# Altium project OSSI-1 COMMS.PrjPcb
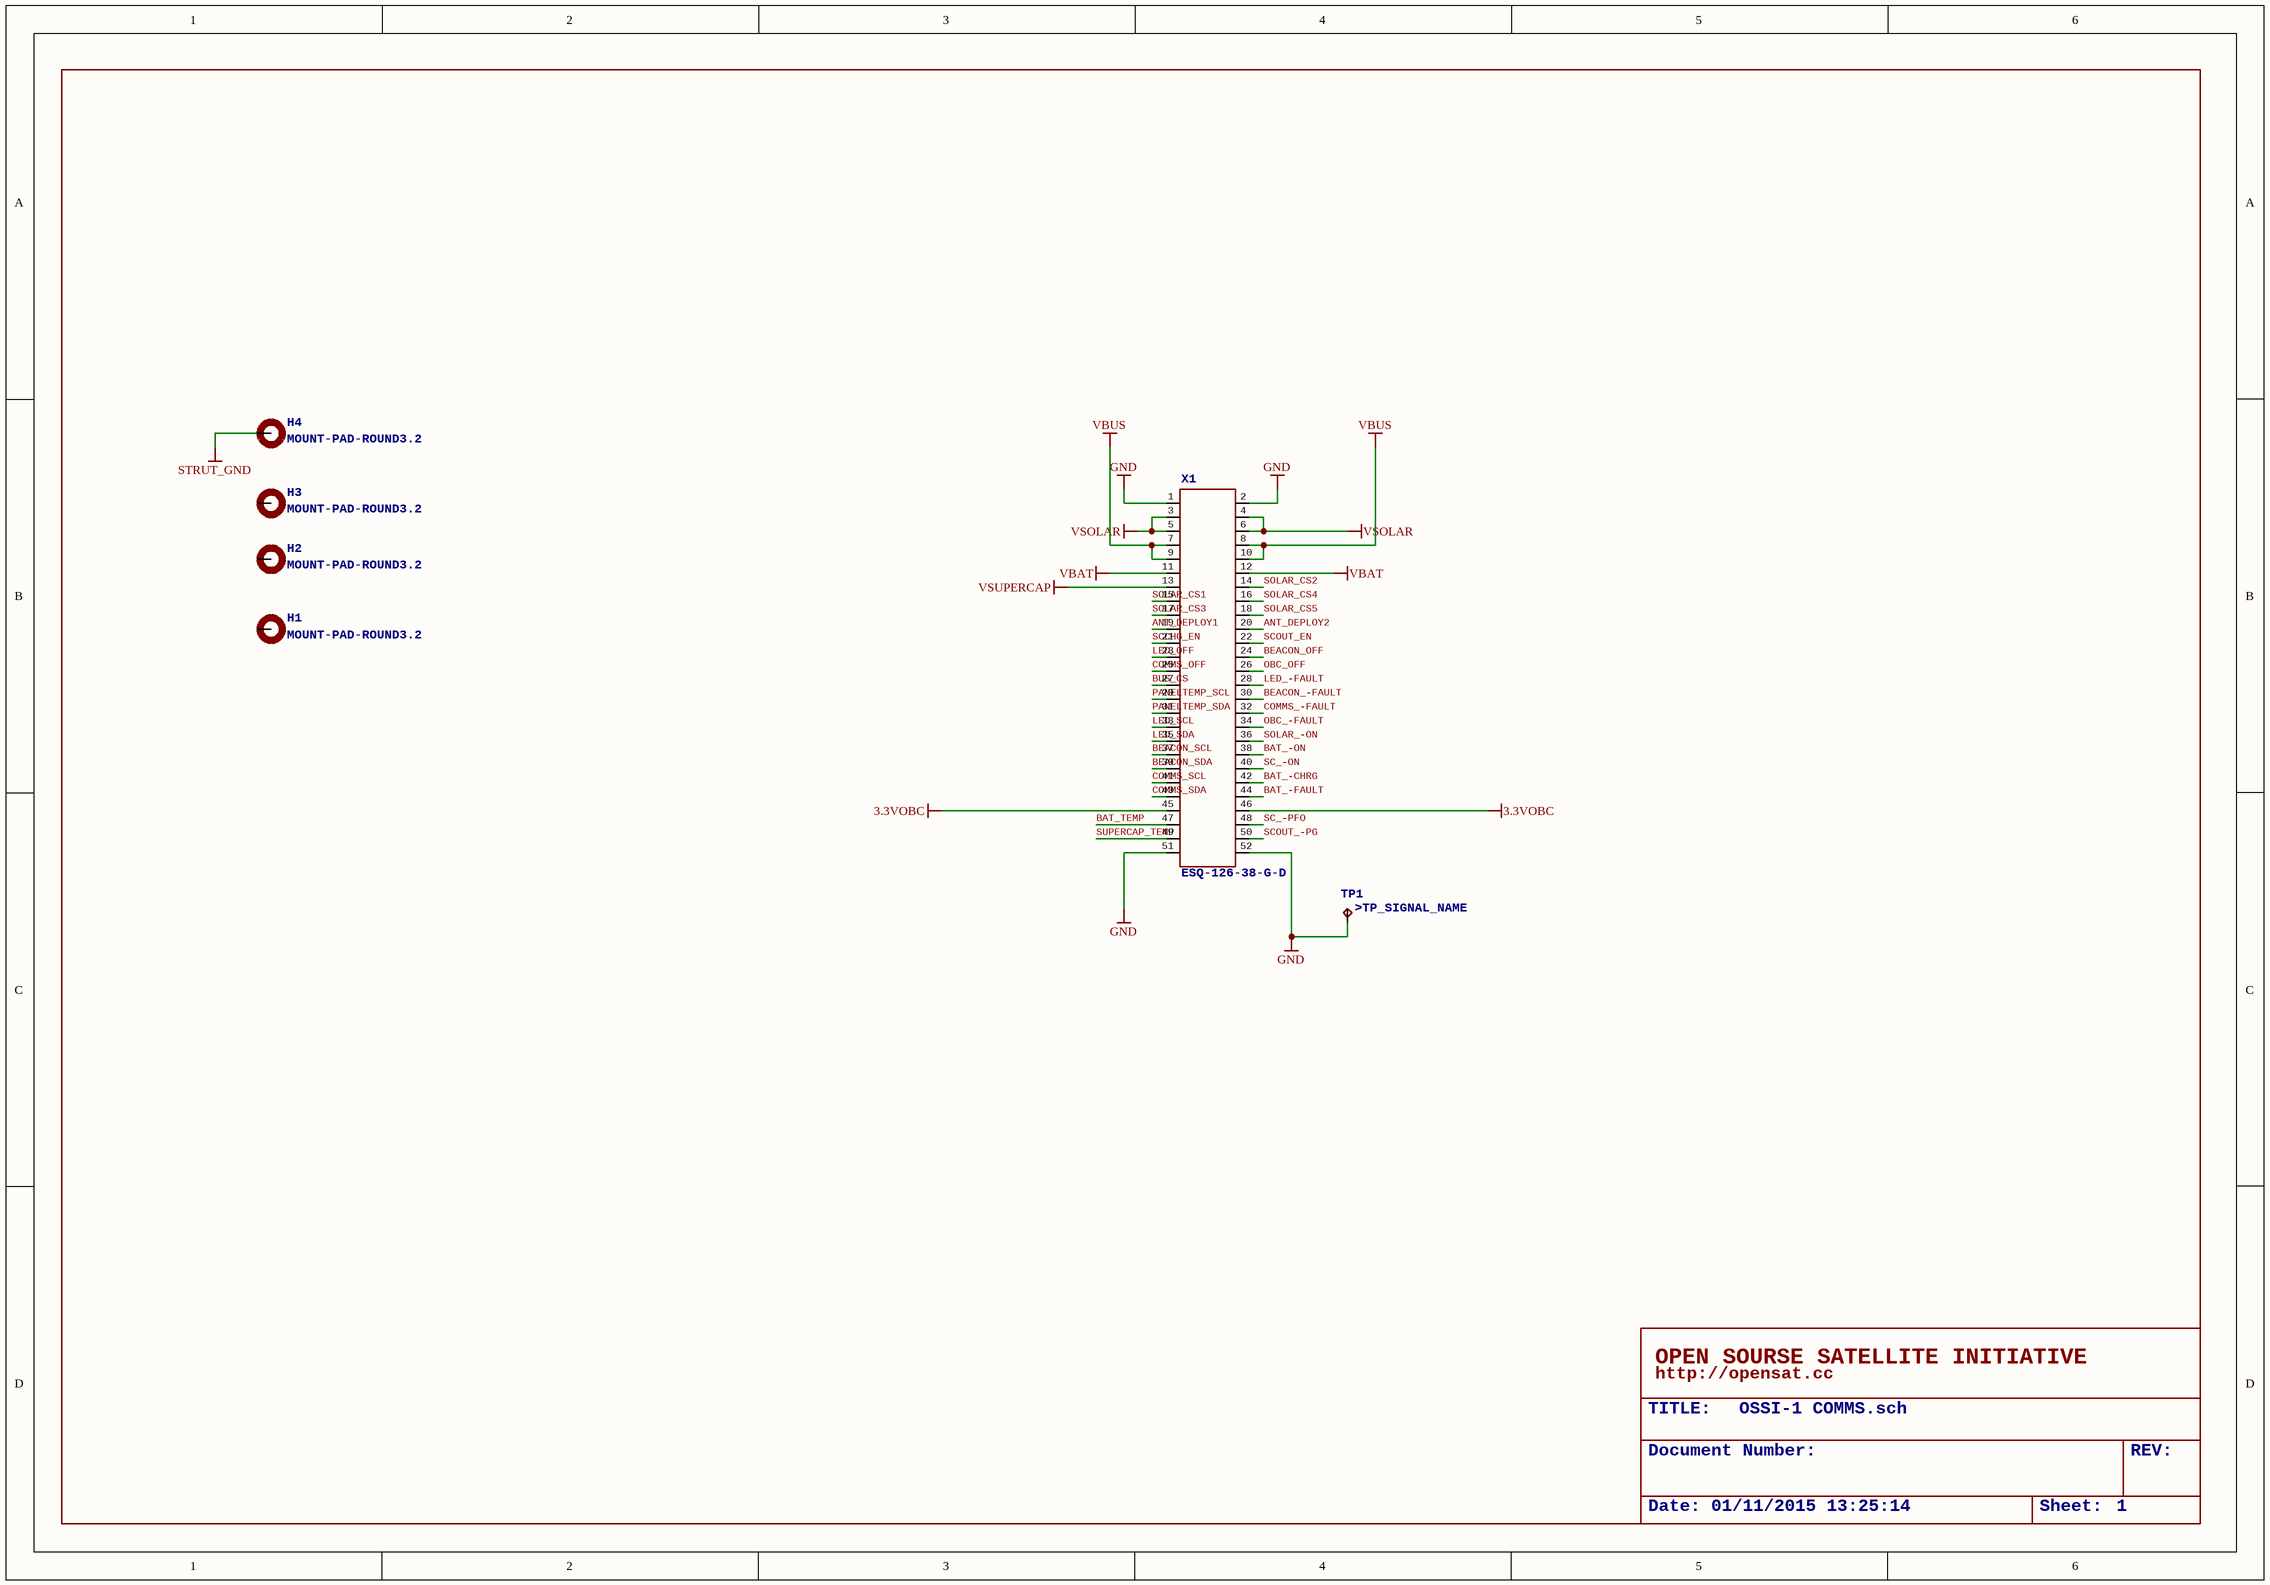
[diagram p0: OSSI-1 COMMS_0.SchDoc]
4 sheets, 188 parts. Net scope: global (net labels, ports and power ports of the same name join across sheets).
Board file: OSSI-1 COMMS.PcbDoc
Sheets:
  OSSI-1 COMMS_0.SchDoc
  OSSI-1 COMMS_1.SchDoc
  OSSI-1 COMMS_2.SchDoc
  OSSI-1 COMMS_3.SchDoc

## Sheet OSSI-1 COMMS_0.SchDoc: TITLE:
size 410 x 286 mm; Date: Date:; >LAST_DATE_TIME: 01/11/2015 13:25:14; Sheet:: Sheet:; >SHEET: 1; REV:: REV:; Document Number:: Document Number:; >DRAWING_NAME: OSSI-1 COMMS.sch

### Parts
H1  >NAME: H1  [3.2-PAD-ROUND]  (hidden comment: MOUNT-PAD-ROUND3.2)
H2  >NAME: H2  [3.2-PAD-ROUND]  (hidden comment: MOUNT-PAD-ROUND3.2)
H3  >NAME: H3  [3.2-PAD-ROUND]  (hidden comment: MOUNT-PAD-ROUND3.2)
H4  >NAME: H4  [3.2-PAD-ROUND]  (hidden comment: MOUNT-PAD-ROUND3.2)
TP1  >NAME: TP1  [TP-13]  (hidden comment: TP)
X1  >NAME: X1  [ESQ-126-XX-X-D]  (hidden comment: ESQ-126-38-G-D)

### Nets
3.3VOBC: X1.45 X1.46
GND: TP1.TP X1.1 X1.2 X1.51 X1.52
STRUT_GND: H4.B3,2(MOUNT)
VBAT: X1.11 X1.12
VBUS: X1.7 X1.8 X1.9 X1.10
VSOLAR: X1.3 X1.4 X1.5 X1.6
VSUPERCAP: X1.13
ANT_DEPLOY1: X1.19
ANT_DEPLOY2: X1.20
BAT_-CHRG: X1.42
BAT_-FAULT: X1.44
BAT_-ON: X1.38
BAT_TEMP: X1.47
BEACON_-FAULT: X1.30
BEACON_OFF: X1.24
BEACON_SCL: X1.37
BEACON_SDA: X1.39
BUS_CS: X1.27
COMMS_-FAULT: X1.32
COMMS_OFF: X1.25
COMMS_SCL: X1.41
COMMS_SDA: X1.43
LED_-FAULT: X1.28
LED_OFF: X1.23
LED_SCL: X1.33
LED_SDA: X1.35
OBC_-FAULT: X1.34
OBC_OFF: X1.26
PANELTEMP_SCL: X1.29
PANELTEMP_SDA: X1.31
SC_-ON: X1.40
SC_-PFO: X1.48
SCCHG_EN: X1.21
SCOUT_-PG: X1.50
SCOUT_EN: X1.22
SOLAR_-ON: X1.36
SOLAR_CS1: X1.15
SOLAR_CS2: X1.14
SOLAR_CS3: X1.17
SOLAR_CS4: X1.16
SOLAR_CS5: X1.18
SUPERCAP_TEMP: X1.49

Not connected (* = marked no-connect by the designer): H1 B3,2(MOUNT); H2 B3,2(MOUNT); H3 B3,2(MOUNT)

### Notes on the sheet
- OPEN SOURSE SATELLITE INITIATIVE
- http://opensat.cc

### Library data of the parts
X1 = ESQ-126-38-G-D: <b>Samtec ESQ-126-XX-G-D Elevated Sockets Seires</b> / <ul> / <li> ESQ-126-37-G-D</li> / <li> ESQ-126-38-G-D</li> / <li> ESQ-126-39-G-D</li> / </ul>; >VALUE: ESQ-126-38-G-D
H1-H4 = MOUNT-PAD-ROUND3.2: >VALUE: MOUNT-PAD-ROUND3.2
TP1 = TP: >TP_SIGNAL_NAME: >TP_SIGNAL_NAME

## Sheet OSSI-1 COMMS_1.SchDoc: TITLE:
size 410 x 287 mm; Date: Date:; >LAST_DATE_TIME: 01/11/2015 13:25:17; Sheet:: Sheet:; >SHEET: 2; REV:: REV:; Document Number:: Document Number:; >DRAWING_NAME: OSSI-1 COMMS.sch
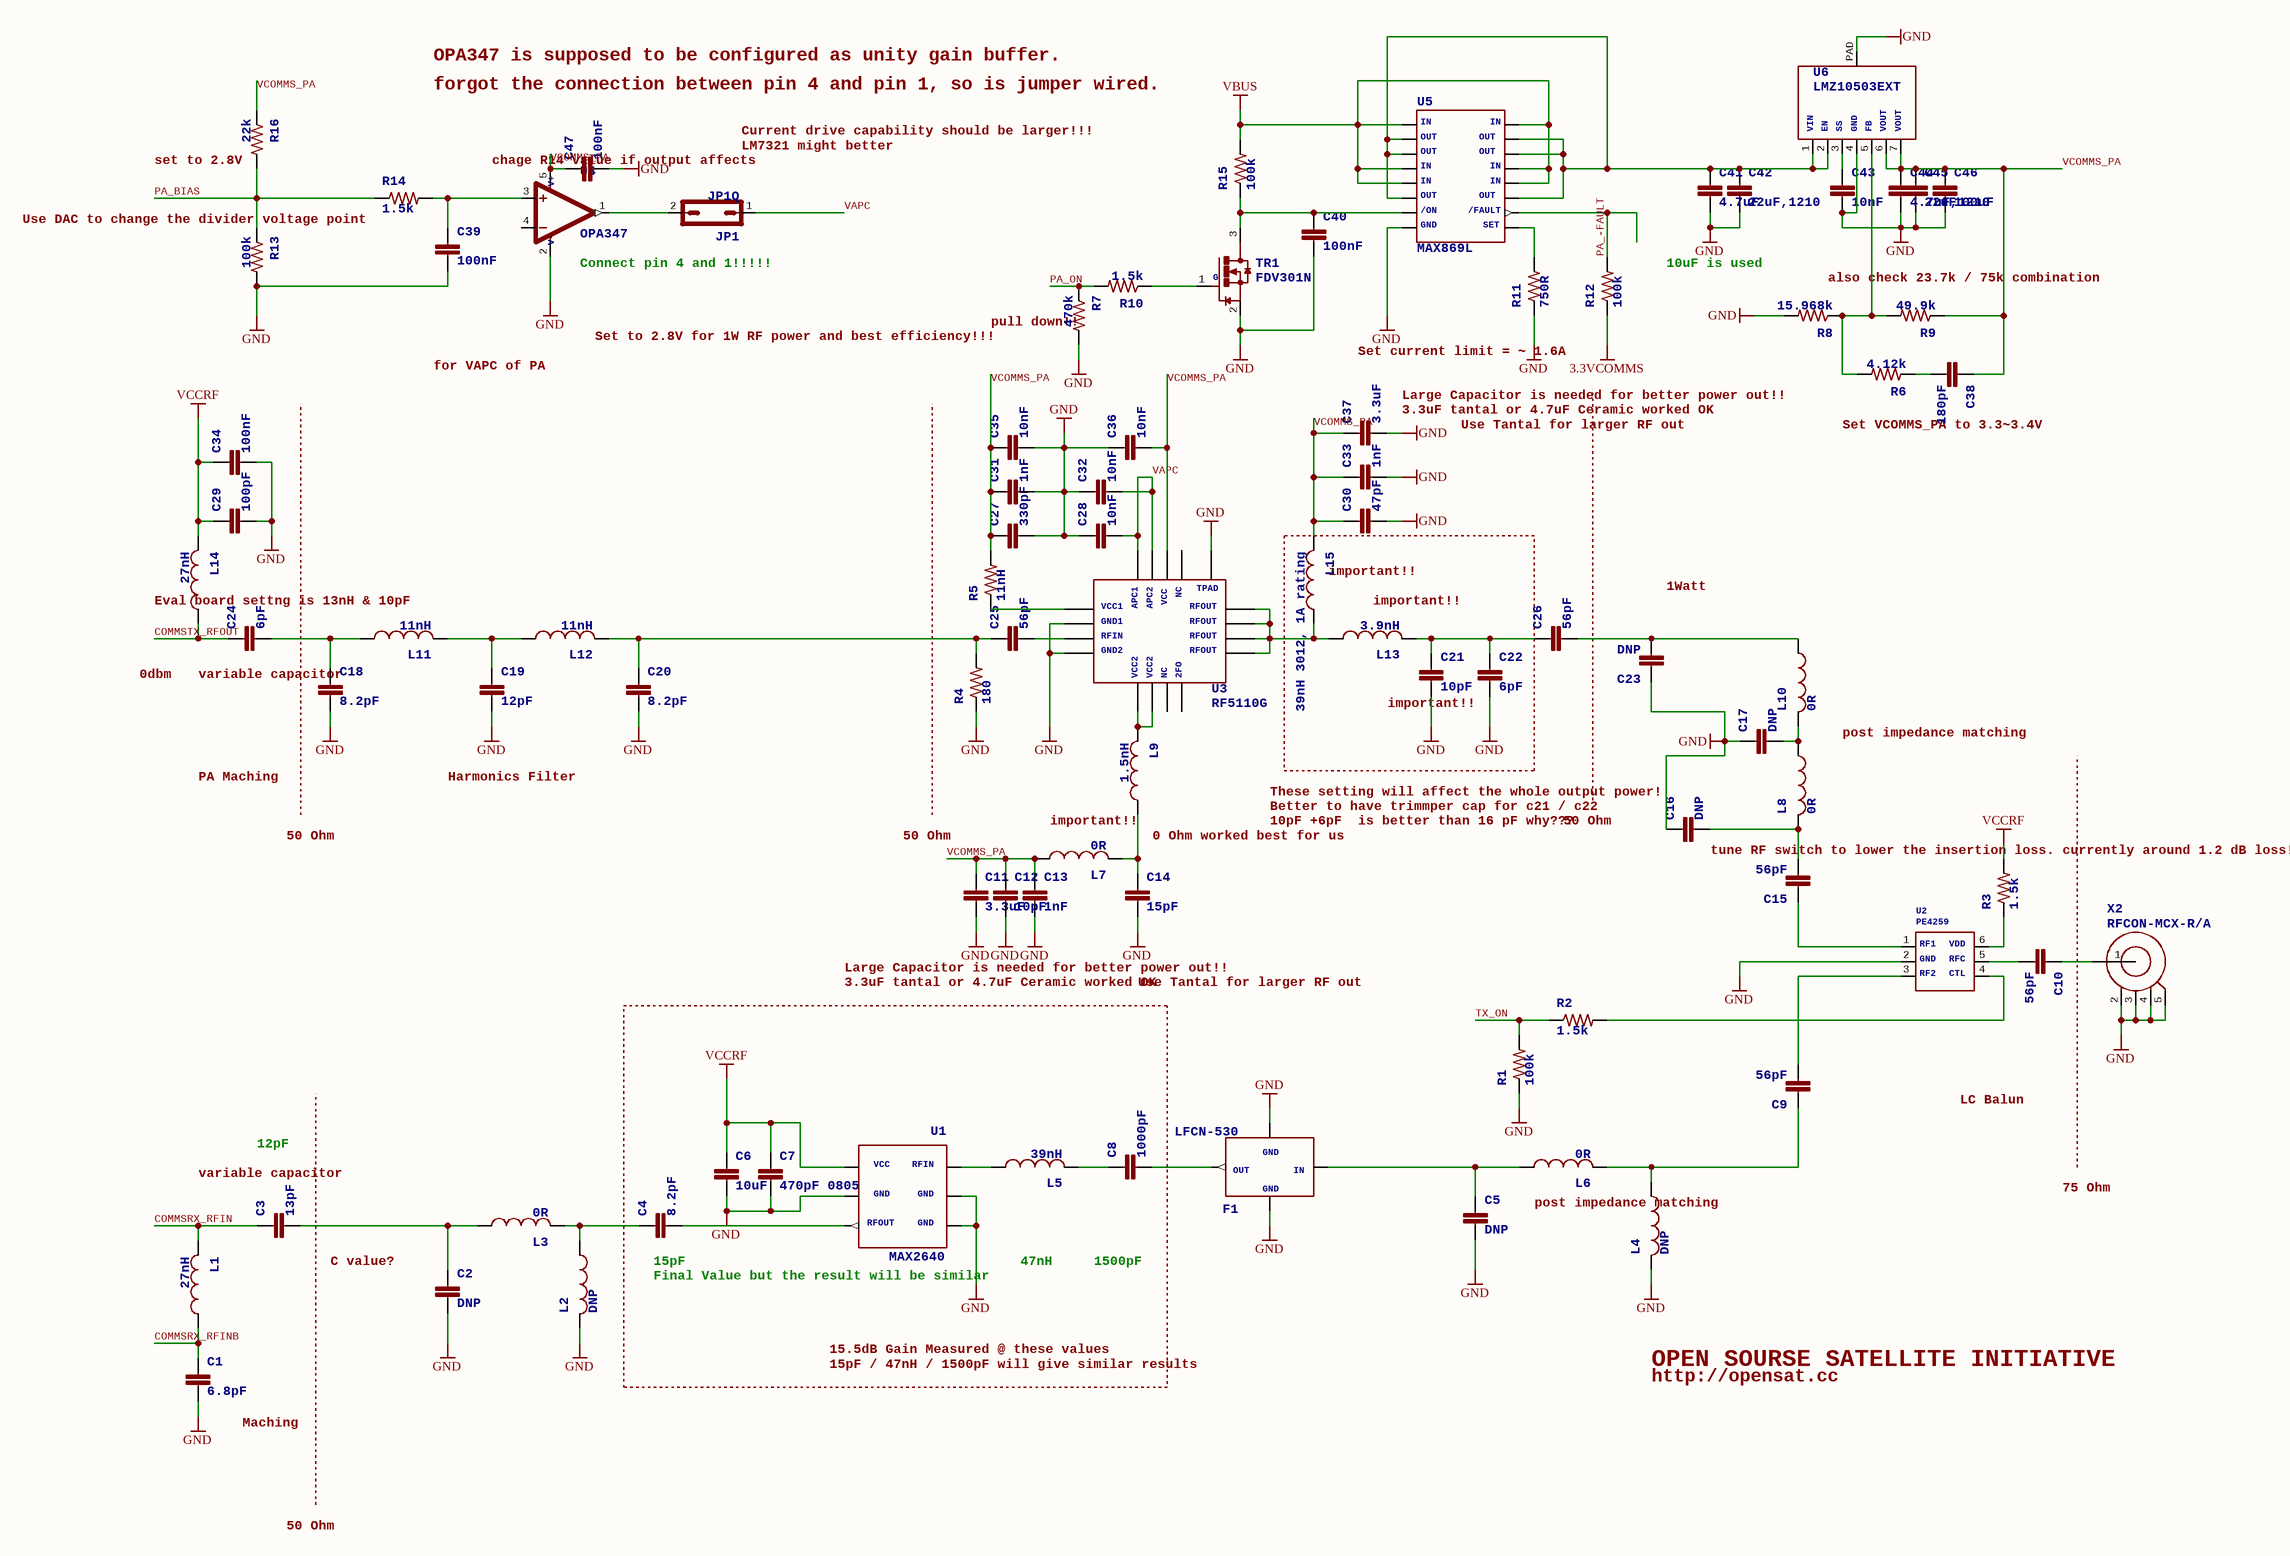
[diagram p1: OSSI-1 COMMS_1.SchDoc]

### Parts
C1  >NAME: C1  [C0603(1608)]  (hidden comment: 6.8pF)
C2  >NAME: C2  [C0603(1608)]  (hidden comment: DNP)
C3  >NAME: C3  [C0603(1608)]  (hidden comment: 13pF)
C4  >NAME: C4  [C0603(1608)]  (hidden comment: 8.2pF)
C5  >NAME: C5  [C0603(1608)]  (hidden comment: DNP)
C6  >NAME: C6  [C1206-GCM31]  (hidden comment: 10uF)
C7  >NAME: C7  [C0805(2012)]  (hidden comment: 470pF 0805)
C8  >NAME: C8  [C0603(1608)]  (hidden comment: 1000pF)
C9  >NAME: C9  [C0603(1608)]  (hidden comment: 56pF)
C10  >NAME: C10  [C0603(1608)]  (hidden comment: 56pF)
C11  >NAME: C11  [C1210-TMK325]  (hidden comment: 3.3uF)
C12  >NAME: C12  [C0603(1608)]  (hidden comment: 10pF)
C13  >NAME: C13  [C0603(1608)]  (hidden comment: 1nF)
C14  >NAME: C14  [C0603(1608)]  (hidden comment: 15pF)
C15  >NAME: C15  [C0603(1608)]  (hidden comment: 56pF)
C16  >NAME: C16  [C0603(1608)]  (hidden comment: DNP)
C17  >NAME: C17  [C0603(1608)]  (hidden comment: DNP)
C18  >NAME: C18  [C0603(1608)]  (hidden comment: 8.2pF)
C19  >NAME: C19  [C0603(1608)]  (hidden comment: 12pF)
C20  >NAME: C20  [C0603(1608)]  (hidden comment: 8.2pF)
C21  >NAME: C21  [C0603(1608)]  (hidden comment: 10pF)
C22  >NAME: C22  [C0603(1608)]  (hidden comment: 6pF)
C23  >NAME: C23  [C0603(1608)]  (hidden comment: DNP)
C24  >NAME: C24  [C0603(1608)]  (hidden comment: 6pF)
C25  >NAME: C25  [C0603(1608)]  (hidden comment: 56pF)
C26  >NAME: C26  [C0603(1608)]  (hidden comment: 56pF)
C27  >NAME: C27  [C0603(1608)]  (hidden comment: 330pF)
C28  >NAME: C28  [C0603(1608)]  (hidden comment: 10nF)
C29  >NAME: C29  [C0603(1608)]  (hidden comment: 100pF)
C30  >NAME: C30  [C0603(1608)]  (hidden comment: 47pF)
C31  >NAME: C31  [C0603(1608)]  (hidden comment: 1nF)
C32  >NAME: C32  [C0603(1608)]  (hidden comment: 10nF)
C33  >NAME: C33  [C0603(1608)]  (hidden comment: 1nF)
C34  >NAME: C34  [C0603(1608)]  (hidden comment: 100nF)
C35  >NAME: C35  [C0603(1608)]  (hidden comment: 10nF)
C36  >NAME: C36  [C0603(1608)]  (hidden comment: 10nF)
C37  >NAME: C37  [C1210-TMK325]  (hidden comment: 3.3uF)
C38  >NAME: C38  [C0603(1608)]  (hidden comment: 180pF)
C39  >NAME: C39  [C0603(1608)]  (hidden comment: 100nF)
C40  >NAME: C40  [C0603(1608)]  (hidden comment: 100nF)
C41  >NAME: C41  [C1210-GCM32]  (hidden comment: 4.7uF)
C42  >NAME: C42  [C1210-GCM32]  (hidden comment: 22uF,1210)
C43  >NAME: C43  [C0603(1608)]  (hidden comment: 10nF)
C44  >NAME: C44  [C0805(2012)]  (hidden comment: 4.7uF,1210)
C45  >NAME: C45  [C1210-GCM32]  (hidden comment: 22uF)
C46  >NAME: C46  [C1210-GCM32]  (hidden comment: 100uF)
C47  >NAME: C47  [C0603(1608)]  (hidden comment: 100nF)
F1  >NAME: F1  [LFCN]  (hidden comment: LFCN-530)
JP1  JP1Q  [JP1]
L1  >NAME: L1  [L0603(1608)]  (hidden comment: 27nH)
L2  >NAME: L2  [L0603(1608)]  (hidden comment: DNP)
L3  >NAME: L3  [L0603(1608)]  (hidden comment: 0R)
L4  >NAME: L4  [L0603(1608)]  (hidden comment: DNP)
L5  >NAME: L5  [L0603(1608)]  (hidden comment: 39nH)
L6  >NAME: L6  [L0603(1608)]  (hidden comment: 0R)
L7  >NAME: L7  [LQH32CN331K23L]  (hidden comment: 0R)
L8  >NAME: L8  [L0603(1608)]  (hidden comment: 0R)
L9  >NAME: L9  [L0603(1608)]  (hidden comment: 1.5nH)
L10  >NAME: L10  [L0603(1608)]  (hidden comment: 0R)
L11  >NAME: L11  [L0603(1608)]  (hidden comment: 11nH)
L12  >NAME: L12  [L0603(1608)]  (hidden comment: 11nH)
L13  >NAME: L13  [L0603(1608)]  (hidden comment: 3.9nH)
L14  >NAME: L14  [L0603(1608)]  (hidden comment: 27nH)
L15  >NAME: L15  [NR3012]  (hidden comment: 39nH 3012, 1A rating)
R1  >NAME: R1  [R0603(1608)]  (hidden comment: 100k)
R2  >NAME: R2  [R0603(1608)]  (hidden comment: 1.5k)
R3  >NAME: R3  [R0603(1608)]  (hidden comment: 1.5k)
R4  >NAME: R4  [R0603(1608)]  (hidden comment: 180)
R5  >NAME: R5  [R0603(1608)]  (hidden comment: 11nH)
R6  >NAME: R6  [R0603(1608)]  (hidden comment: 4.12k)
R7  >NAME: R7  [R0603(1608)]  (hidden comment: 470k)
R8  >NAME: R8  [R0603(1608)]  (hidden comment: 15.968k)
R9  >NAME: R9  [R0603(1608)]  (hidden comment: 49.9k)
R10  >NAME: R10  [R0603(1608)]  (hidden comment: 1.5k)
R11  >NAME: R11  [R0603(1608)]  (hidden comment: 750R)
R12  >NAME: R12  [R0603(1608)]  (hidden comment: 100k)
R13  >NAME: R13  [R0603(1608)]  (hidden comment: 100k)
R14  >NAME: R14  [R0603(1608)]  (hidden comment: 1.5k)
R15  >NAME: R15  [R0603(1608)]  (hidden comment: 100k)
R16  >NAME: R16  [R0603(1608)]  (hidden comment: 22k)
TR1  >NAME: TR1  [SOT23]  (hidden comment: FDV301N)
U1  >NAME: U1  [SOT23-6]  (hidden comment: MAX2640)
U2  >NAME: U2  [SC70-6]  (hidden comment: PE4259)
U3  >NAME: U3  [RF5110G]  (hidden comment: RF5110G)
U4  >NAME: U4  [SOT23-5DBV]  (hidden comment: OPA347)
U5  >NAME: U5  [16QSOP]  (hidden comment: MAX869L)
U6  >NAME: U6  [TO-PMOD-7]  (hidden comment: LMZ10503EXT)
X2  >NAME: X2  [MCX-R/A]  (hidden comment: RFCON-MCX-R/A)

### Nets
3.3VCOMMS: R12.1
GND: C1.2 C2.2 C5.2 C6.P$2 C7.2 C11.P$2 C12.2 C13.2 C14.2 C16.1 C17.1 C18.2 C19.2 C20.2 C21.2 C22.2 C23.1 C27.2 C28.1 C29.2 C30.2 C31.2 C32.1 C33.2 C34.2 C35.2 C36.1 C37.P$2 C39.2 C40.2 C41.P$2 C42.P$2 C43.2 C44.2 C45.P$2 C46.P$2 C47.2 F1.2(P$2) F1.4(P$4) L2.2 L4.2 R1.1 R4.1 R7.2 R8.2 R11.1 R13.2 TR1.2(S) U1.2 U1.3 U1.5 U2.2(P$2) U3.2(P$2) U3.4(P$4) U3.TPAD(P$17) U4.2(V-) U5.8(P$8) U6.4(P$4) U6.PAD(P$8) X2.2 X2.3 X2.4 X2.5
VBUS: R15.2 U5.1(P$1) U5.4(P$4) U5.5(P$5) U5.12(P$12) U5.13(P$13) U5.16(P$16)
VCCRF: C6.P$1 C7.1 C29.1 C34.1 L14.2 R3.2 U1.6
COMMSRX_RFIN: C3.1 L1.2
COMMSRX_RFINB: C1.1 L1.1
COMMSTX_RFOUT: C24.1 L14.1
PA_-FAULT: R12.2 U5.10(P$10)
PA_BIAS: R13.1 R14.1 R16.2
PA_ON: R7.1 R10.2
TX_ON: R1.2 R2.1
VAPC: C28.2 C32.2 JP1.1 U3.15(P$15) U3.16(P$16)
VCOMMS_PA: C11.P$1 C12.1 C13.1 C27.1 C30.1 C31.1 C33.1 C35.1 C36.2 C37.P$1 C38.1 C44.1 C45.P$1 C46.P$1 C47.1 L7.P$1 L15.P$2 R5.2 R9.1 R16.1 U3.14(P$14) U4.5(V+) U6.6(P$6) U6.7(P$7)
NetC2_1: C2.1 C3.2 L3.1
NetC4_1: C4.1 L2.1 L3.2
NetC4_2: C4.2 U1.4
NetC5_1: C5.1 F1.1(P$1) L6.1
NetC8_1: C8.1 L5.2
NetC8_2: C8.2 F1.3(P$3)
NetC9_1: C9.1 L4.1 L6.2
NetC9_2: C9.2 U2.3(P$3)
NetC10_1: C10.1 X2.1
NetC10_2: C10.2 U2.5(P$5)
NetC14_1: C14.1 L7.P$2 L9.1
NetC15_1: C15.1 U2.1(P$1)
NetC15_2: C15.2 C16.2 L8.2
NetC17_2: C17.2 L8.1 L10.2
NetC18_1: C18.1 C24.2 L11.1
NetC19_1: C19.1 L11.2 L12.1
NetC20_1: C20.1 C25.1 L12.2 R4.2
NetC21_1: C21.1 C22.1 C26.1 L13.2
NetC23_2: C23.2 C26.2 L10.1
NetC25_2: C25.2 U3.3(P$3)
NetC38_2: C38.2 R6.1
NetC39_1: C39.1 R14.2 U4.3(+IN)
NetC40_1: C40.1 R15.1 TR1.3(D) U5.7(P$7)
NetC41_P$1: C41.P$1 C42.P$1 U5.2(P$2) U5.3(P$3) U5.6(P$6) U5.11(P$11) U5.14(P$14) U5.15(P$15) U6.1(P$1) U6.2(P$2)
NetC43_1: C43.1 U6.3(P$3)
NetJP1_2: JP1.2 U4.1(OUT)
NetL5_1: L5.1 U1.1
NetL9_2: L9.2 U3.5(P$5) U3.6(P$6)
NetL13_1: L13.1 L15.P$1 U3.9(P$9) U3.10(P$10) U3.11(P$11) U3.12(P$12)
NetR2_2: R2.2 U2.4(P$4)
NetR3_1: R3.1 U2.6(P$6)
NetR5_1: R5.1 U3.1(P$1)
NetR6_2: R6.2 R8.1 R9.2 U6.5(P$5)
NetR10_1: R10.1 TR1.1(G)
NetR11_2: R11.2 U5.9(P$9)

Not connected (* = marked no-connect by the designer): U3 7(P$7) 8(P$8) 13(P$13); U4 4(-IN)

### Notes on the sheet
- OPA347 is supposed to be configured as unity gain buffer.
- forgot the connection between pin 4 and pin 1, so is jumper wired.
- Current drive capability should be larger!!!
- LM7321 might better
- (near R13) Use DAC to change the divider voltage point
- (near R16) set to 2.8V
- (near C47) chage R14 value if output affects
- (near U4) Connect pin 4 and 1!!!!!
- 10uF is used
- also check 23.7k / 75k combination
- for VAPC of PA
- Set to 2.8V for 1W RF power and best efficiency!!!
- (near R7) pull down!!
- (near R11) Set current limit = ~ 1.6A
- (near C37) 3.3uF tantal or 4.7uF Ceramic worked OK
- (near C37) Large Capacitor is needed for better power out!!
- Use Tantal for larger RF out
- Set VCOMMS_PA to 3.3~3.4V
- (near L15) important!!
- 1Watt
- (near L14) Eval board settng is 13nH & 10pF
- (near L13) important!!
- 0dbm
- (near C18) variable capacitor
- (near C21) important!!
- post impedance matching
- PA Maching
- Harmonics Filter
- These setting will affect the whole output power!
- Better to have trimmper cap for c21 / c22
- 50 Ohm
- important!!
- 0 Ohm worked best for us
- 10pF +6pF  is better than 16 pF why???
- tune RF switch to lower the insertion loss. currently around 1.2 dB loss!!!!
- 3.3uF tantal or 4.7uF Ceramic worked OK
- Large Capacitor is needed for better power out!!
- LC Balun
- (near C3) variable capacitor
- 12pF
- (near L4) post impedance matching
- 75 Ohm
- C value?
- (near C4) 15pF
- Final Value but the result will be similar
- 47nH
- 1500pF
- 15.5dB Gain Measured @ these values
- 15pF / 47nH / 1500pF will give similar results
- OPEN SOURSE SATELLITE INITIATIVE
- http://opensat.cc
- (near C1) Maching

### Library data of the parts
C1-C5 C8-C10 C12-C36 C38-C40 C43 C47 = C0603(1608)
  C1: >VALUE: 6.8pF
  C2 C5 C16 C17 C23: >VALUE: DNP
  C3: >VALUE: 13pF
  C4 C18 C20: >VALUE: 8.2pF
  C8: >VALUE: 1000pF
  C9 C10 C15 C25 C26: >VALUE: 56pF
  C12 C21: >VALUE: 10pF
  C13 C31 C33: >VALUE: 1nF
  C14: >VALUE: 15pF
  C19: >VALUE: 12pF
  C22 C24: >VALUE: 6pF
  C27: >VALUE: 330pF
  C28 C32 C35 C36 C43: >VALUE: 10nF
  C29: >VALUE: 100pF
  C30: >VALUE: 47pF
  C34 C39 C40 C47: >VALUE: 100nF
  C38: >VALUE: 180pF
C6 = C1206(3216)-GCM31: >VALUE: 10uF
C7 C44 = C0805(2012)
  C7: >VALUE: 470pF 0805
  C44: >VALUE: 4.7uF,1210
C11 C37 = C1210(3225)-TMK325: >VALUE: 3.3uF
C41 C42 C45 C46 = C1210(3225)-GCM32
  C41: >VALUE: 4.7uF
  C42: >VALUE: 22uF,1210
  C45: >VALUE: 22uF
  C46: >VALUE: 100uF
F1 = LFCN-160: <b>LFCN-160 Low Pass Filter</b> / <ul> / <li>DC - 160MHz Low Pass Filter</li> / <li>Cut Off Freq: 230MHz</li> / <li>8W power rating ( degraded to 3W at 100 celcius degree)</li> / </ul>; IN: IN; OUT: OUT; GND: GND; >VALUE: LFCN-530
JP1 = JP1Q: <b>JUMPER</b>; >NAME: JP1; >VALUE: JP1Q
L1-L6 L8-L14 = L0603(1608)
  L1 L14: >VALUE: 27nH
  L2 L4: >VALUE: DNP
  L3 L6 L8 L10: >VALUE: 0R
  L5: >VALUE: 39nH
  L9: >VALUE: 1.5nH
  L11 L12: >VALUE: 11nH
  L13: >VALUE: 3.9nH
L7 = LLQH32CN: >VALUE: 0R
L15 = LNR3012: >VALUE: 39nH 3012, 1A rating
R1-R16 = R0603(1608)
  R1 R12 R13 R15: >VALUE: 100k
  R2 R3 R10 R14: >VALUE: 1.5k
  R4: >VALUE: 180
  R5: >VALUE: 11nH
  R6: >VALUE: 4.12k
  R7: >VALUE: 470k
  R8: >VALUE: 15.968k
  R9: >VALUE: 49.9k
  R11: >VALUE: 750R
  R16: >VALUE: 22k
TR1 = FDV301N: FDV301N Digital N channel - FET / Rdson = 5 Ohm / Vgs = 0.7~1.06V / Ids = 220mA; G: G; >VALUE: FDV301N
U1 = MAX2640: <b>MAX2640 </b> / <ul> / <li>ultra-low-noise amplifiers</li> / <li>operating frequency: 300MHz to 2500MHz </li> / <li>+2.7V to +5.5V Single-Supply Operation  </li> / <li>Low 3.5mA Supply Current </li> / </ul>; RFIN: RFIN; GND: GND; RFOUT: RFOUT; VCC: VCC; >VALUE: MAX2640
U3 = RF5110G: <b>RF5110G</b> / <br /> / 3V GSM RF Power Amplifirer / <br /> / +36dBm Output Power at 3.5V; VCC1: VCC1; GND1: GND1; RFIN: RFIN; GND2: GND2; VCC2: VCC2; NC: NC; 2FO: 2FO; RFOUT: RFOUT; VCC: VCC; APC2: APC2; APC1: APC1; >VALUE: RF5110G; TPAD: TPAD
U4 = OPA347: <b>OPA347</b> / <ul> / <li>RAIL-TO-RAIL INPUT AND OUTPUT</li> / <li>SINGLE SUPPLY: 2.3V to 5.5V</li> / <li>LOW IQ: 20µ</li> / </ul>; >VALUE: OPA347; V+: V+; V-: V-
U5 = MAX869L: 2A, Current-Limited, High-Side / P-Channel Switch with Thermal Shutdown; IN: IN; OUT: OUT; GND: GND; /ON: /ON; /FAULT: /FAULT; SET: SET; >VALUE: MAX869L
U6 = LMZ10503EXT: LMZ10503EXT / June 14, 2011 / 3A SIMPLE SWITCHER® Power Module with 5.5V Maximum / Input Voltage for Military and Rugged Applications; VIN: VIN; EN: EN; SS: SS; GND: GND; FB: FB; VOUT: VOUT; >VALUE: LMZ10503EXT
X2 = RFCON-MCX-R/A: RF Connectors; >VALUE: RFCON-MCX-R/A
U2 = PE4259: RF1: RF1; GND: GND; RF2: RF2; CTL: CTL; RFC: RFC; VDD: VDD; >VALUE: PE4259

## Sheet OSSI-1 COMMS_2.SchDoc: TITLE:
size 410 x 286 mm; Date: Date:; >LAST_DATE_TIME: 01/11/2015 13:25:20; Sheet:: Sheet:; >SHEET: 3; REV:: REV:; Document Number:: Document Number:; >DRAWING_NAME: OSSI-1 COMMS.sch
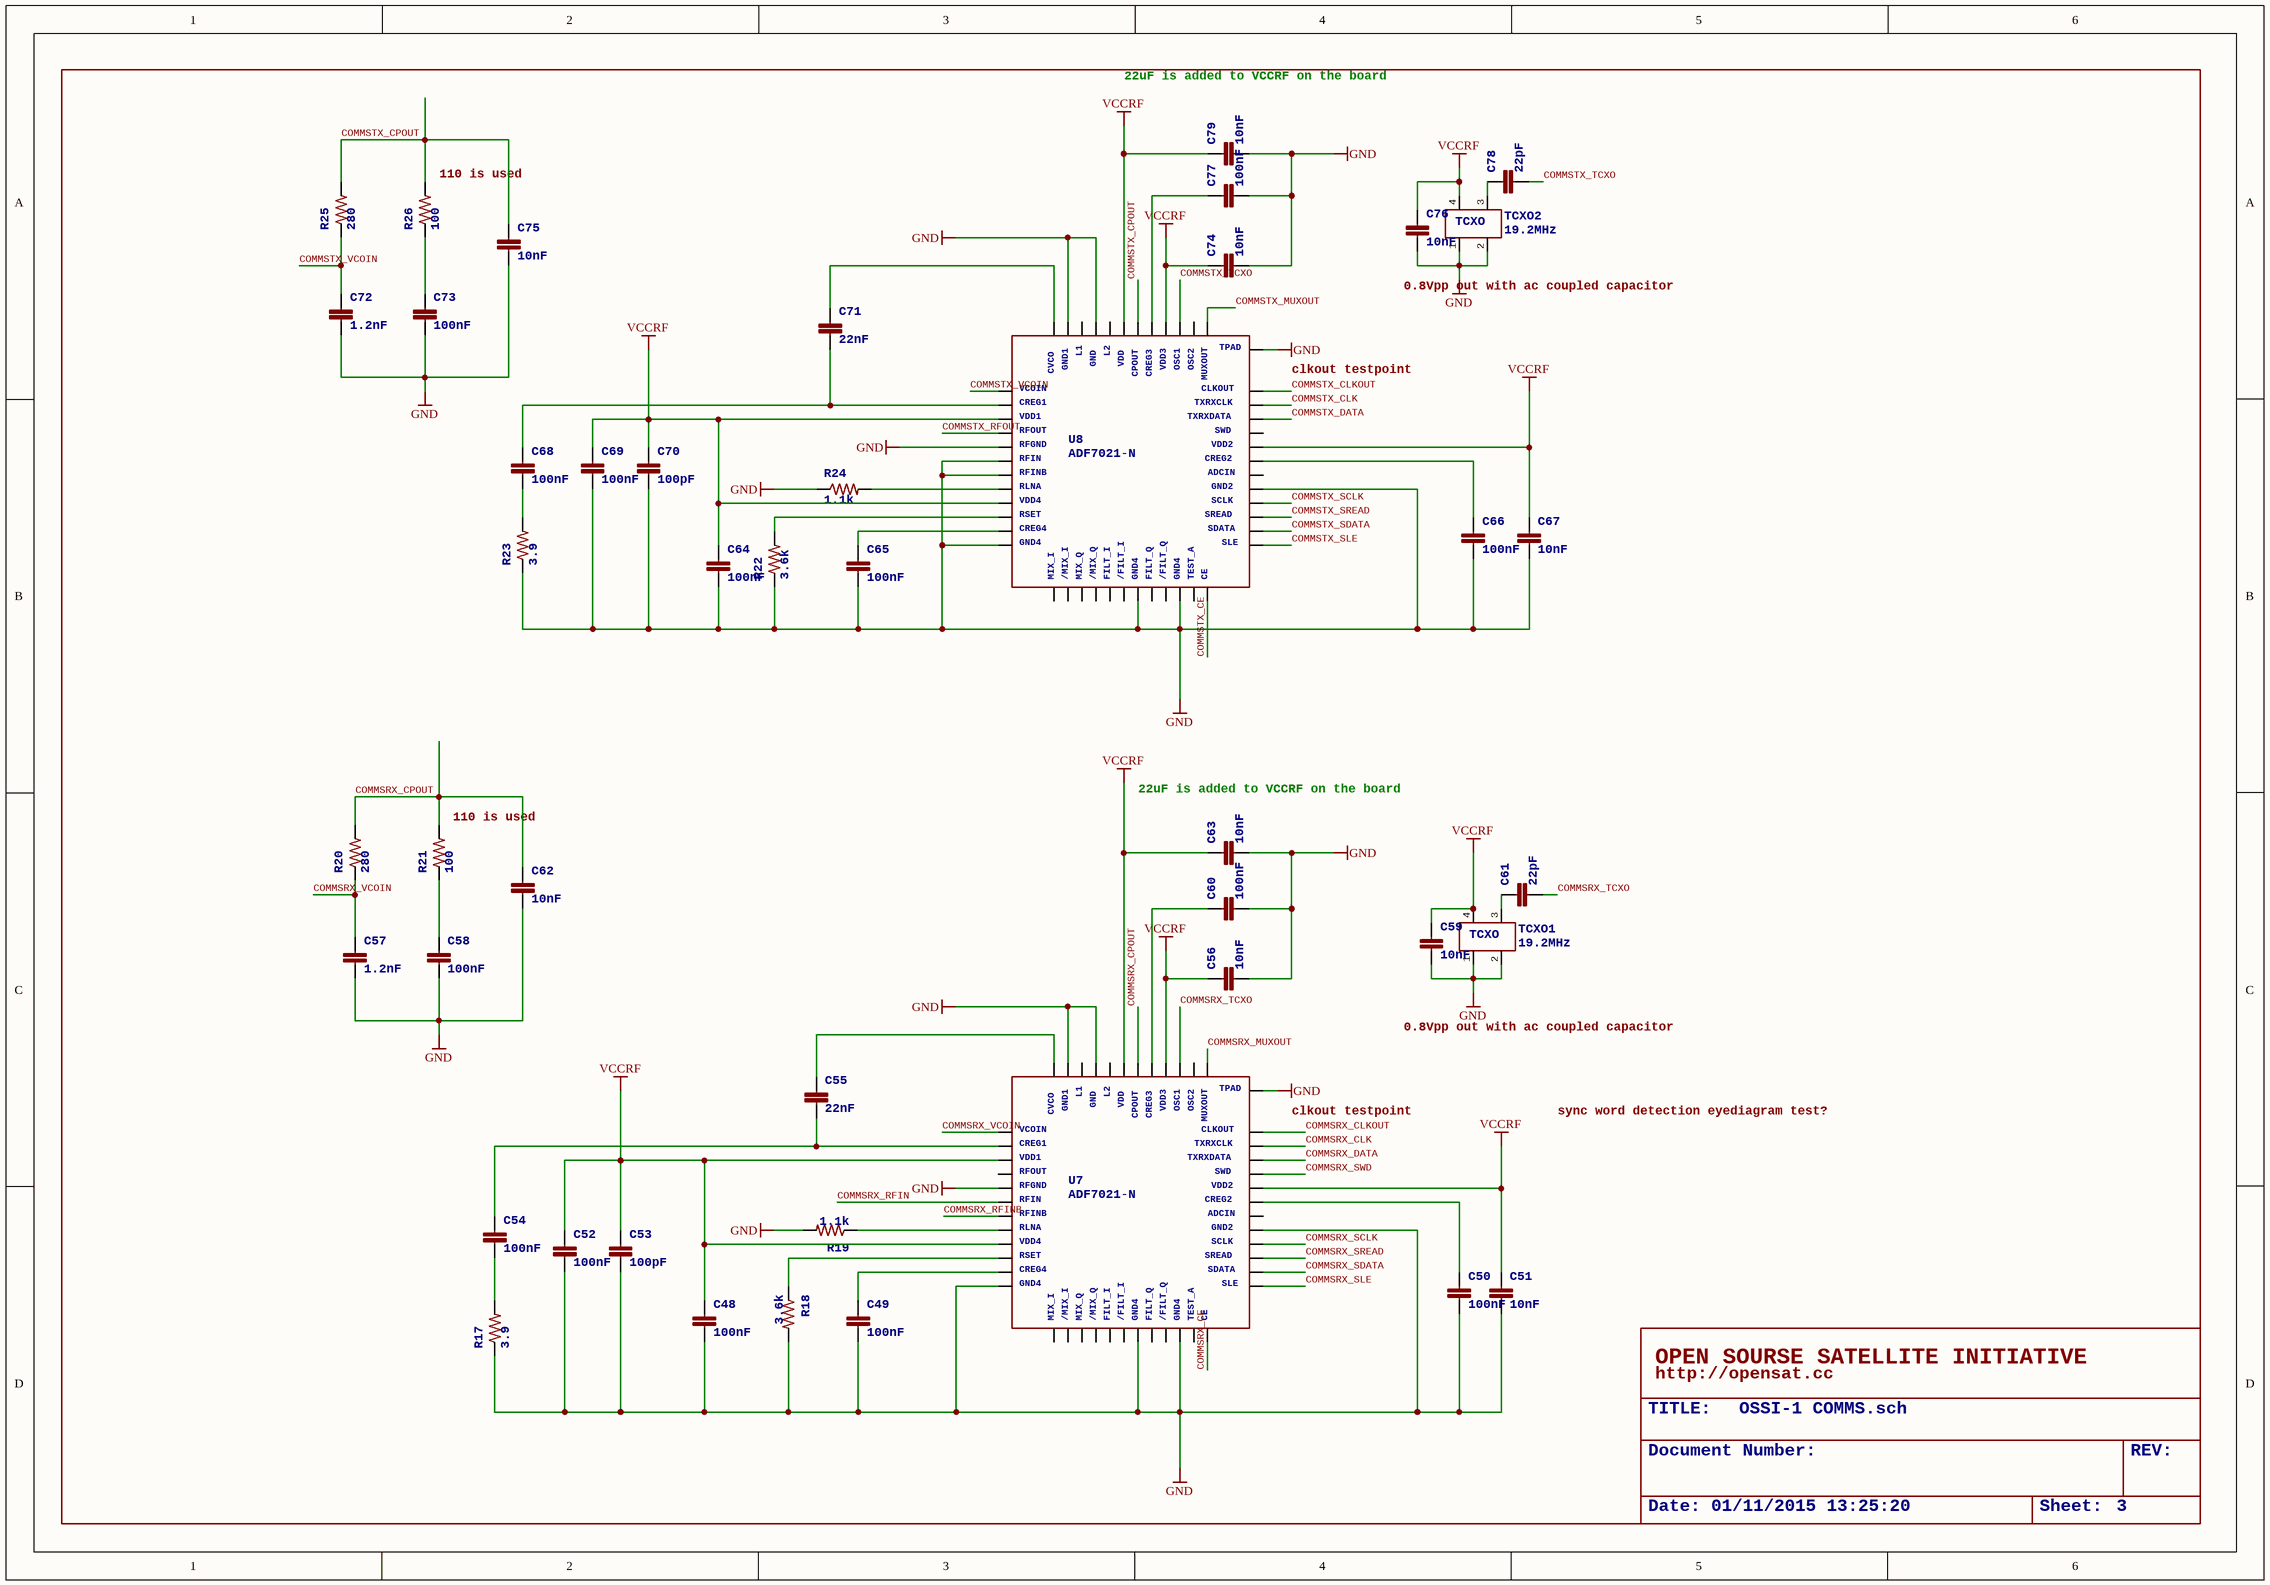
[diagram p2: OSSI-1 COMMS_2.SchDoc]

### Parts
C48  >NAME: C48  [C0603(1608)]  (hidden comment: 100nF)
C49  >NAME: C49  [C0603(1608)]  (hidden comment: 100nF)
C50  >NAME: C50  [C0603(1608)]  (hidden comment: 100nF)
C51  >NAME: C51  [C0603(1608)]  (hidden comment: 10nF)
C52  >NAME: C52  [C0603(1608)]  (hidden comment: 100nF)
C53  >NAME: C53  [C0603(1608)]  (hidden comment: 100pF)
C54  >NAME: C54  [C0603(1608)]  (hidden comment: 100nF)
C55  >NAME: C55  [C0603(1608)]  (hidden comment: 22nF)
C56  >NAME: C56  [C0603(1608)]  (hidden comment: 10nF)
C57  >NAME: C57  [C0603(1608)]  (hidden comment: 1.2nF)
C58  >NAME: C58  [C0603(1608)]  (hidden comment: 100nF)
C59  >NAME: C59  [C0603(1608)]  (hidden comment: 10nF)
C60  >NAME: C60  [C0603(1608)]  (hidden comment: 100nF)
C61  >NAME: C61  [C0603(1608)]  (hidden comment: 22pF)
C62  >NAME: C62  [C0603(1608)]  (hidden comment: 10nF)
C63  >NAME: C63  [C0603(1608)]  (hidden comment: 10nF)
C64  >NAME: C64  [C0603(1608)]  (hidden comment: 100nF)
C65  >NAME: C65  [C0603(1608)]  (hidden comment: 100nF)
C66  >NAME: C66  [C0603(1608)]  (hidden comment: 100nF)
C67  >NAME: C67  [C0603(1608)]  (hidden comment: 10nF)
C68  >NAME: C68  [C0603(1608)]  (hidden comment: 100nF)
C69  >NAME: C69  [C0603(1608)]  (hidden comment: 100nF)
C70  >NAME: C70  [C0603(1608)]  (hidden comment: 100pF)
C71  >NAME: C71  [C0603(1608)]  (hidden comment: 22nF)
C72  >NAME: C72  [C0603(1608)]  (hidden comment: 1.2nF)
C73  >NAME: C73  [C0603(1608)]  (hidden comment: 100nF)
C74  >NAME: C74  [C0603(1608)]  (hidden comment: 10nF)
C75  >NAME: C75  [C0603(1608)]  (hidden comment: 10nF)
C76  >NAME: C76  [C0603(1608)]  (hidden comment: 10nF)
C77  >NAME: C77  [C0603(1608)]  (hidden comment: 100nF)
C78  >NAME: C78  [C0603(1608)]  (hidden comment: 22pF)
C79  >NAME: C79  [C0603(1608)]  (hidden comment: 10nF)
R17  >NAME: R17  [R0603(1608)]  (hidden comment: 3.9)
R18  >NAME: R18  [R0603(1608)]  (hidden comment: 3.6k)
R19  >NAME: R19  [R0603(1608)]  (hidden comment: 1.1k)
R20  >NAME: R20  [R0603(1608)]  (hidden comment: 280)
R21  >NAME: R21  [R0603(1608)]  (hidden comment: 100)
R22  >NAME: R22  [R0603(1608)]  (hidden comment: 3.6k)
R23  >NAME: R23  [R0603(1608)]  (hidden comment: 3.9)
R24  >NAME: R24  [R0603(1608)]  (hidden comment: 1.1k)
R25  >NAME: R25  [R0603(1608)]  (hidden comment: 280)
R26  >NAME: R26  [R0603(1608)]  (hidden comment: 100)
TCXO1  >NAME: TCXO1  [TCXO_M532]  (hidden comment: 19.2MHz)
TCXO2  >NAME: TCXO2  [TCXO_M532]  (hidden comment: 19.2MHz)
U7  >NAME: U7  [LFCSP48]  (hidden comment: ADF7021-N)
U8  >NAME: U8  [LFCSP48]  (hidden comment: ADF7021-N)

### Nets
GND: C48.2 C49.2 C50.2 C51.2 C52.2 C53.2 C56.2 C57.2 C58.2 C59.2 C60.2 C62.2 C63.2 C64.2 C65.2 C66.2 C67.2 C69.2 C70.2 C72.2 C73.2 C74.2 C75.2 C76.2 C77.2 C79.2 R17.1 R18.2 R19.2 R22.1 R23.1 R24.1 TCXO1.1(P$1) TCXO1.2(P$2) TCXO2.1(P$1) TCXO2.2(P$2) U7.5(P$5) U7.12(P$12) U7.19(P$19) U7.22(P$22) U7.29(P$29) U7.45(P$45) U7.47(P$47) U7.EXP(P$49) U8.5(P$5) U8.6(P$6) U8.7(P$7) U8.12(P$12) U8.19(P$19) U8.22(P$22) U8.29(P$29) U8.45(P$45) U8.47(P$47) U8.EXP(P$49)
VCCRF: C48.1 C51.1 C52.1 C53.1 C56.1 C59.1 C63.1 C64.1 C67.1 C69.1 C70.1 C74.1 C76.1 C79.1 TCXO1.4(P$4) TCXO2.4(P$4) U7.3(P$3) U7.9(P$9) U7.32(P$32) U7.40(P$40) U7.43(P$43) U8.3(P$3) U8.9(P$9) U8.32(P$32) U8.40(P$40) U8.43(P$43)
COMMSRX_CE: U7.24(P$24)
COMMSRX_CLK: U7.35(P$35)
COMMSRX_CLKOUT: U7.36(P$36)
COMMSRX_CPOUT: C62.1 R20.2 R21.2 U7.42(P$42)
COMMSRX_DATA: U7.34(P$34)
COMMSRX_MUXOUT: U7.37(P$37)
COMMSRX_RFIN: U7.6(P$6)
COMMSRX_RFINB: U7.7(P$7)
COMMSRX_SCLK: U7.28(P$28)
COMMSRX_SDATA: U7.26(P$26)
COMMSRX_SLE: U7.25(P$25)
COMMSRX_SREAD: U7.27(P$27)
COMMSRX_SWD: U7.33(P$33)
COMMSRX_TCXO: C61.2 U7.39(P$39)
COMMSRX_VCOIN: C57.1 R20.1 U7.1(P$1)
COMMSTX_CE: U8.24(P$24)
COMMSTX_CLK: U8.35(P$35)
COMMSTX_CLKOUT: U8.36(P$36)
COMMSTX_CPOUT: C75.1 R25.2 R26.2 U8.42(P$42)
COMMSTX_DATA: U8.34(P$34)
COMMSTX_MUXOUT: U8.37(P$37)
COMMSTX_RFOUT: U8.4(P$4)
COMMSTX_SCLK: U8.28(P$28)
COMMSTX_SDATA: U8.26(P$26)
COMMSTX_SLE: U8.25(P$25)
COMMSTX_SREAD: U8.27(P$27)
COMMSTX_TCXO: C78.2 U8.39(P$39)
COMMSTX_VCOIN: C72.1 R25.1 U8.1(P$1)
NetC49_1: C49.1 U7.11(P$11)
NetC50_1: C50.1 U7.31(P$31)
NetC54_1: C54.1 C55.2 U7.2(P$2)
NetC54_2: C54.2 R17.2
NetC55_1: C55.1 U7.48(P$48)
NetC58_1: C58.1 R21.1
NetC60_1: C60.1 U7.41(P$41)
NetC61_1: C61.1 TCXO1.3(P$3)
NetC65_1: C65.1 U8.11(P$11)
NetC66_1: C66.1 U8.31(P$31)
NetC68_1: C68.1 C71.2 U8.2(P$2)
NetC68_2: C68.2 R23.2
NetC71_1: C71.1 U8.48(P$48)
NetC73_1: C73.1 R26.1
NetC77_1: C77.1 U8.41(P$41)
NetC78_1: C78.1 TCXO2.3(P$3)
NetR18_1: R18.1 U7.10(P$10)
NetR19_1: R19.1 U7.8(P$8)
NetR22_2: R22.2 U8.10(P$10)
NetR24_2: R24.2 U8.8(P$8)

Not connected (* = marked no-connect by the designer): U7 4(P$4) 13(P$13) 14(P$14) 15(P$15) 16(P$16) 17(P$17) 18(P$18) 20(P$20) 21(P$21) 23(P$23) 30(P$30) 38(P$38) 44(P$44) 46(P$46); U8 13(P$13) 14(P$14) 15(P$15) 16(P$16) 17(P$17) 18(P$18) 20(P$20) 21(P$21) 23(P$23) 30(P$30) 33(P$33) 38(P$38) 44(P$44) 46(P$46)

### Notes on the sheet
- 22uF is added to VCCRF on the board
- (near R26) 110 is used
- 0.8Vpp out with ac coupled capacitor
- (near U8) clkout testpoint
- (near R21) 110 is used
- (near U7) clkout testpoint
- sync word detection eyediagram test?
- OPEN SOURSE SATELLITE INITIATIVE
- http://opensat.cc

### Library data of the parts
C48-C79 = C0603(1608)
  C48-C50 C52 C54 C58 C60 C64-C66 C68 C69 C73 C77: >VALUE: 100nF
  C51 C56 C59 C62 C63 C67 C74-C76 C79: >VALUE: 10nF
  C53 C70: >VALUE: 100pF
  C55 C71: >VALUE: 22nF
  C57 C72: >VALUE: 1.2nF
  C61 C78: >VALUE: 22pF
R17-R26 = R0603(1608)
  R17 R23: >VALUE: 3.9
  R18 R22: >VALUE: 3.6k
  R19 R24: >VALUE: 1.1k
  R20 R25: >VALUE: 280
  R21 R26: >VALUE: 100
TCXO1 TCXO2 = TCXO-M532: <b>532L25DT19M2000: CTO electronic components Model 532 19.2MHz TCXO for RF transeiver</b> / <ul> / <li>Clipped Sine Wave Output</li> / <li>Operating Voltage, +3.3Vdc</li> / <li>Operating Temperature to -30°C to +85°C</li> / <li>Frequency Stability: ±2.5ppm</li> / </ul>; TCXO: TCXO; >VALUE: 19.2MHz
U7 U8 = ADF7021-N: <B>ADF7021-N</B> / <br /> / RF transceiver from analog device; VCOIN: VCOIN; CREG1: CREG1; VDD1: VDD1; RFOUT: RFOUT; RFGND: RFGND; RFIN: RFIN; RFINB: RFINB; RLNA: RLNA; VDD4: VDD4; RSET: RSET; CREG4: CREG4; GND4: GND4; MIX_I: MIX_I; /MIX_I: /MIX_I; MIX_Q: MIX_Q; /MIX_Q: /MIX_Q; FILT_I: FILT_I; /FILT_I: /FILT_I; TEST_A: TEST_A; FILT_Q: FILT_Q; /FILT_Q: /FILT_Q; CE: CE; SLE: SLE; SDATA: SDATA; SREAD: SREAD; SCLK: SCLK; GND2: GND2; ADCIN: ADCIN; CREG2: CREG2; VDD2: VDD2; SWD: SWD; TXRXDATA: TXRXDATA; TXRXCLK: TXRXCLK; CLKOUT: CLKOUT; MUXOUT: MUXOUT; OSC2: OSC2; OSC1: OSC1; VDD3: VDD3; CREG3: CREG3; CPOUT: CPOUT; VDD: VDD; L2: L2; GND: GND; L1: L1; GND1: GND1; CVCO: CVCO; >VALUE: ADF7021-N; TPAD: TPAD

## Sheet OSSI-1 COMMS_3.SchDoc: TITLE:
size 410 x 286 mm; Date: Date:; >LAST_DATE_TIME: 01/11/2015 13:25:23; Sheet:: Sheet:; >SHEET: 4; REV:: REV:; Document Number:: Document Number:; >DRAWING_NAME: OSSI-1 COMMS.sch
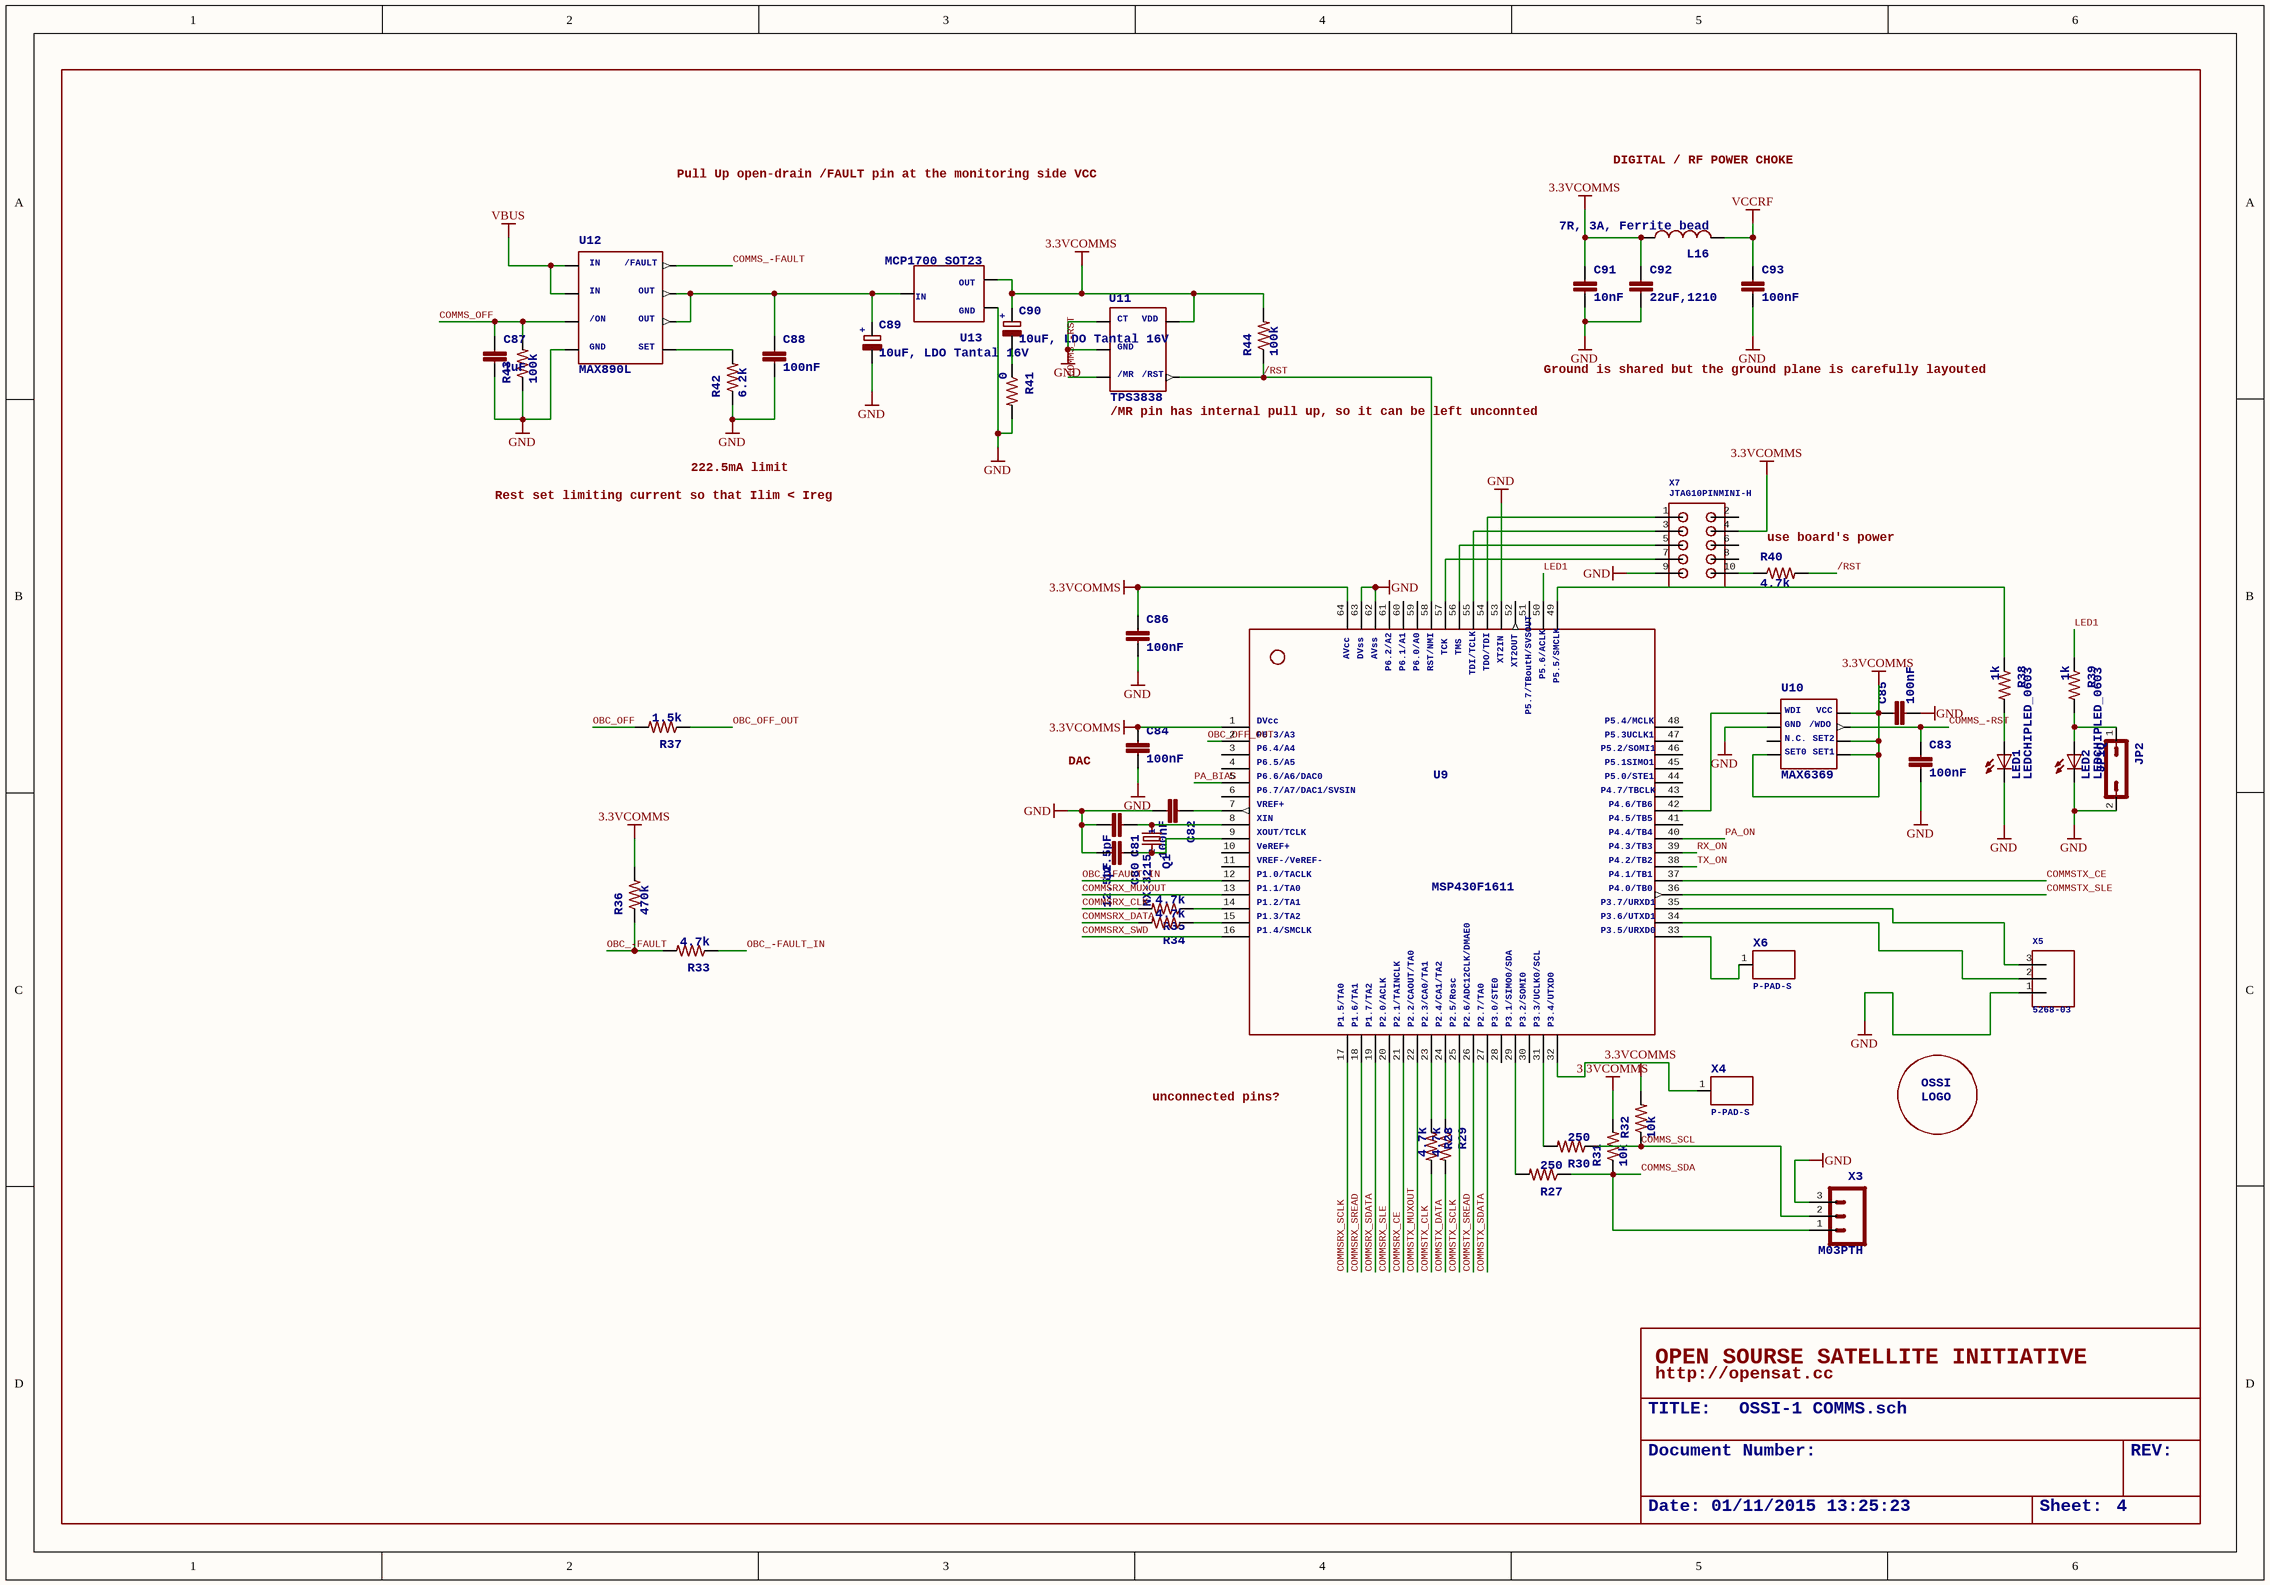
[diagram p3: OSSI-1 COMMS_3.SchDoc]

### Parts
C80  >NAME: C80  [C0603(1608)]  (hidden comment: 12.5pF)
C81  >NAME: C81  [C0603(1608)]  (hidden comment: 12.5pF)
C82  >NAME: C82  [C0603(1608)]  (hidden comment: 100nF)
C83  >NAME: C83  [C0603(1608)]  (hidden comment: 100nF)
C84  >NAME: C84  [C0603(1608)]  (hidden comment: 100nF)
C85  >NAME: C85  [C0603(1608)]  (hidden comment: 100nF)
C86  >NAME: C86  [C0603(1608)]  (hidden comment: 100nF)
C87  >NAME: C87  [C0603(1608)]  (hidden comment: 1uF)
C88  >NAME: C88  [C0603(1608)]  (hidden comment: 100nF)
C89  >NAME: C89  [C1206(3216)-A]  (hidden comment: 10uF, LDO Tantal 16V)
C90  >NAME: C90  [C1206(3216)-A]  (hidden comment: 10uF, LDO Tantal 16V)
C91  >NAME: C91  [C0603(1608)]  (hidden comment: 10nF)
C92  >NAME: C92  [C1210-GCM32]  (hidden comment: 22uF,1210)
C93  >NAME: C93  [C0603(1608)]  (hidden comment: 100nF)
JP2  >NAME: JP2  [JP1]  (hidden comment: JP1Q)
L16  >NAME: L16  [L0805(2012)]  (hidden comment: 7R, 3A, Ferrite bead)
LED1  >NAME: LED1  [CHIPLED_0603]  (hidden comment: LEDCHIPLED_0603)
LED2  >NAME: LED2  [CHIPLED_0603]  (hidden comment: LEDCHIPLED_0603)
Q1  >NAME: Q1  [NX-3215]  (hidden comment: NX-3215)
R27  >NAME: R27  [R0603(1608)]  (hidden comment: 250)
R28  >NAME: R28  [R0603(1608)]  (hidden comment: 4.7k)
R29  >NAME: R29  [R0603(1608)]  (hidden comment: 4.7k)
R30  >NAME: R30  [R0603(1608)]  (hidden comment: 250)
R31  >NAME: R31  [R0603(1608)]  (hidden comment: 10k)
R32  >NAME: R32  [R0603(1608)]  (hidden comment: 10k)
R33  >NAME: R33  [R0603(1608)]  (hidden comment: 4.7k)
R34  >NAME: R34  [R0603(1608)]  (hidden comment: 4.7k)
R35  >NAME: R35  [R0603(1608)]  (hidden comment: 4.7k)
R36  >NAME: R36  [R0603(1608)]  (hidden comment: 470k)
R37  >NAME: R37  [R0603(1608)]  (hidden comment: 1.5k)
R38  >NAME: R38  [R0603(1608)]  (hidden comment: 1k)
R39  >NAME: R39  [R0603(1608)]  (hidden comment: 1k)
R40  >NAME: R40  [R0603(1608)]  (hidden comment: 4.7k)
R41  >NAME: R41  [R0603(1608)]  (hidden comment: 0)
R42  >NAME: R42  [R0603(1608)]  (hidden comment: 6.2k)
R43  >NAME: R43  [R0603(1608)]  (hidden comment: 100k)
R44  >NAME: R44  [R0603(1608)]  (hidden comment: 100k)
U9  >NAME: U9  [PM/PAG64]  (hidden comment: MSP430F1611)
U10  >NAME: U10  [SOT23-8]  (hidden comment: MAX6369)
U11  >NAME: U11  [SOT23-5DBV]  (hidden comment: TPS3838)
U12  >NAME: U12  [SO8]  (hidden comment: MAX890L)
U13  >NAME: U13  [SOT23]  (hidden comment: MCP1700_SOT23)
U$1  OSSILOGORECT  [OSSILOGORECT1005]  (value not drawn)
X3  >NAME: X3  [1X03]  (hidden comment: M03PTH)
X4  >NAME: X4  [P-PAD-S]  (hidden comment: P-PAD-S)
X5  >NAME: X5  [5268-03]  (hidden comment: 5268-03)
X6  >NAME: X6  [P-PAD-S]  (hidden comment: P-PAD-S)
X7  >NAME: X7  [M50-3200545]  (hidden comment: JTAG10PINMINI-H)

### Nets
3.3VCOMMS: C84.1 C85.1 C86.1 C90.1(+) C91.1 C92.P$1 L16.1 R31.2 R32.2 R36.2 R44.2 U9.1 U9.64 U10.4(P$4) U10.5(P$5) U10.6(P$6) U10.8(P$8) U11.5(P$5) U13.2 X7.4
GND: C80.2 C81.2 C82.2 C83.2 C84.2 C85.2 C86.2 C87.2 C88.2 C89.2(-) C91.2 C92.P$2 C93.2 JP2.2 LED1.C LED2.C R41.2 R42.1 R43.1 U9.53 U9.62 U9.63 U10.2(P$2) U11.1(P$1) U11.2(P$2) U12.4(P$4) U13.1 X3.3 X5.1 X7.9
VBUS: U12.1(P$1) U12.2(P$2)
VCCRF: C93.1 L16.2
/RST: R40.2 R44.1 U9.58 U11.4(P$4)
COMMS_-FAULT: U12.8(P$8)
COMMS_-RST: C83.1 U10.7(P$7) U11.3(P$3)
COMMS_OFF: C87.1 R43.2 U12.3(P$3)
COMMS_SCL: R30.1 R32.1 X3.2
COMMS_SDA: R27.1 R31.1 X3.1
COMMSRX_CE: U9.21
COMMSRX_CLK: R35.2
COMMSRX_DATA: R34.2
COMMSRX_MUXOUT: U9.13
COMMSRX_SCLK: U9.17
COMMSRX_SDATA: U9.19
COMMSRX_SLE: U9.20
COMMSRX_SREAD: U9.18
COMMSRX_SWD: U9.16
COMMSTX_CE: U9.37
COMMSTX_CLK: R28.2
COMMSTX_DATA: R29.2
COMMSTX_MUXOUT: U9.22
COMMSTX_SCLK: U9.25
COMMSTX_SDATA: U9.27
COMMSTX_SLE: U9.36
COMMSTX_SREAD: U9.26
LED1: R39.1 U9.50
OBC_-FAULT: R33.2 R36.1
OBC_-FAULT_IN: R33.1 U9.12
OBC_OFF: R37.2
OBC_OFF_OUT: R37.1 U9.2
PA_BIAS: U9.5
PA_ON: U9.40
RX_ON: U9.39
TX_ON: U9.38
NetC80_1: C80.1 Q1.2 U9.9
NetC81_1: C81.1 Q1.1 U9.8
NetC82_1: C82.1 U9.7
NetC88_1: C88.1 C89.1(+) U12.6(P$6) U12.7(P$7) U13.3
NetC90_2: C90.2(-) R41.1
NetJP2_1: JP2.1 LED2.A R39.2
NetLED1_A: LED1.A R38.2
NetR27_2: R27.2 U9.29
NetR28_1: R28.1 U9.23
NetR29_1: R29.1 U9.24
NetR30_2: R30.2 U9.31
NetR34_1: R34.1 U9.15
NetR35_1: R35.1 U9.14
NetR38_1: R38.1 U9.49
NetR40_1: R40.1 X7.10
NetR42_2: R42.2 U12.5(P$5)
NetU9_32: U9.32 X4.1(P$1)
NetU9_33: U9.33 X6.1(P$1)
NetU9_34: U9.34 X5.2
NetU9_35: U9.35 X5.3
NetU9_42: U9.42 U10.1(P$1)
NetU9_54: U9.54 X7.1
NetU9_55: U9.55 X7.3
NetU9_56: U9.56 X7.5
NetU9_57: U9.57 X7.7

Not connected (* = marked no-connect by the designer): U9 3 4 6 10 11 28 30 41 43 44 45 46 47 48 51 52 59 60 61; U10 3(P$3); X7 2 6 8

### Notes on the sheet
- Pull Up open-drain /FAULT pin at the monitoring side VCC
- DIGITAL / RF POWER CHOKE
- (near U11) /MR pin has internal pull up, so it can be left unconnted
- Ground is shared but the ground plane is carefully layouted
- 222.5mA limit
- Rest set limiting current so that Ilim < Ireg
- (near R40) use board's power
- DAC
- unconnected pins?
- OPEN SOURSE SATELLITE INITIATIVE
- http://opensat.cc

### Library data of the parts
C80-C88 C91 C93 = C0603(1608)
  C80 C81: >VALUE: 12.5pF
  C82-C86 C88 C93: >VALUE: 100nF
  C87: >VALUE: 1uF
  C91: >VALUE: 10nF
C89 C90 = C-TANTAL-A: <b>TAJA105M020RNJ</b> / <ul> / <li>Tantal Capacitor / </li> / <li>Manufacturer: AVX / </li> / <li>1206(3126) / </li> / <li>Ref: www.avx.com/docs/techinfo/tantappl.pdf</li> / </ul>; +: +; >VALUE: 10uF, LDO Tantal 16V
C92 = C1210(3225)-GCM32: >VALUE: 22uF,1210
JP2 = JP1Q: <b>JUMPER</b>; >VALUE: JP1Q
L16 = L0805(2012): >VALUE: 7R, 3A, Ferrite bead
LED1 LED2 = LEDCHIPLED_0603: <b>LED</b><p> / <u>OSRAM</u>:<br> / - <u>CHIPLED</u><br> / LG R971, LG N971, LY N971, LG Q971, LY Q971, LO R971, LY R971 / LH N974, LH R974<br> / LS Q976, LO Q976, LY Q976<br> / LO Q996<br> / - <u>Hyper CHIPLED</u><br> / LW Q18S<br> / LB Q993, LB Q99A, LB R99A<br> / - <u>SideLED</u><br> / LS A670, LO A670, LY A670, LG A670, LP A670<br> / LB A673, LV A673, LT A673, LW A673<br> / LH A674<br> / LY A675<br> / LS A676, LA A676, LO A676, LY A676, LW A676<br> / LS A679, LY A679, LG A679<br> / -  <u>Hyper Micro SIDELED®</u><br> / LS Y876, LA Y876, LO Y876, LY Y876<br> / LT Y87S<br> / - <u>SmartLED</u><br> / LW L88C, LW L88S<br> / LB L89C, LB L89S, LG L890<br> / LS L89K, LO L89K, LY L89K<br> / LS L896, LA L896, LO L896, LY L896<br> / - <u>TOPLED</u><br> / LS T670, LO T670, LY T670, LG T670, LP T670<br> / LSG T670, LSP T670, LSY T670, LOP T670, LYG T670<br> / LG T671, LOG T671, LSG T671<br> / LB T673, LV T673, LT T673, LW T673<br> / LH T674<br> / LS T676, LA T676, LO T676, LY T676, LB T676, LH T676, LSB T676, LW T676<br> / LB T67C, LV T67C, LT T67C, LS T67K, LO T67K, LY T67K, LW E67C<br> / LS E67B, LA E67B, LO E67B, LY E67B, LB E67C, LV E67C, LT E67C<br> / LW T67C<br> / LS T679, LY T679, LG T679<br> / LS T770, LO T770, LY T770, LG T770, LP T770<br> / LB T773, LV T773, LT T773, LW T773<br> / LH T774<br> / LS E675, LA E675, LY E675, LS T675<br> / LS T776, LA T776, LO T776, LY T776, LB T776<br> / LHGB T686<br> / LT T68C, LB T68C<br> / - <u>Hyper Mini TOPLED®</u><br> / LB M676<br> / - <u>Mini TOPLED Santana®</u><br> / LG M470<br> / LS M47K, LO M47K, LY M47K / <p> / Source: http://www.osram.convergy.de<p> / <u>LUXEON:</u><br> / - <u>LUMILED®</u><br> / LXK2-PW12-R00, LXK2-PW12-S00, LXK2-PW14-U00, LXK2-PW14-V00<br> / LXK2-PM12-R00, LXK2-PM12-S00, LXK2-PM14-U00<br> / LXK2-PE12-Q00, LXK2-PE12-R00, LXK2-PE12-S00, LXK2-PE14-T00, LXK2-PE14-U00<br> / LXK2-PB12-K00, LXK2-PB12-L00, LXK2-PB12-M00, LXK2-PB14-N00, LXK2-PB14-P00, LXK2-PB14-Q00<br> / LXK2-PR12-L00, LXK2-PR12-M00, LXK2-PR14-Q00, LXK2-PR14-R00<br> / LXK2-PD12-Q00, LXK2-PD12-R00, LXK2-PD12-S00<br> / LXK2-PH12-R00, LXK2-PH12-S00<br> / LXK2-PL12-P00, LXK2-PL12-Q00, LXK2-PL12-R00 / <p> / Source: www.luxeon.com<p> / <u>KINGBRIGHT:</U><p> / KA-3528ASYC<br> / Source: www.kingbright.com; >VALUE: LEDCHIPLED_0603
Q1 = NX-3215: NDK 32.768 kHz SMD Crystal<br /> / P/N: NX3215SA-32.768K-STD-MUA-9<br /> / <br /> / <b>Nominal frequency (kHz):</b> 32.768 <br/> / <b>Package Size (L×W×H : mm):</b>  3.2×1.5×0.8 <br/> / <b>Operating Temperature Range(*1)  /  Storage Temperature Range   (°C):</b>  -40 to +85  /  -40 to +85<br/> / <b>Level of drive:</b>   0.1µW (Max. 0.5µW) <br/> / <b>Frequency Tolerance (25±3°C):</b>  ±20×10-6 <br/> / <b>Load Capacitance:</b>  9.0pF, 12.5pF <br/> / <b>Equivalent Series Resistance:</b>  70kΩ Max.<br/> / <b>Ordering Code:</b>  NX3215SA-32.768K-STD-MUA-9 (Load Capacitance9.0pF) /NX3215SA-32.768K-STD-MUA-8 (Load Capacitance12.5pF); >VALUE: NX-3215; 1: 1; 2: 2
R27-R44 = R0603(1608)
  R27 R30: >VALUE: 250
  R28 R29 R33-R35 R40: >VALUE: 4.7k
  R31 R32: >VALUE: 10k
  R36: >VALUE: 470k
  R37: >VALUE: 1.5k
  R38 R39: >VALUE: 1k
  R41: >VALUE: 0
  R42: >VALUE: 6.2k
  R43 R44: >VALUE: 100k
U9 = MSP430F1611: <b>MSP430F1611</b>; AVcc: AVcc; DVss: DVss; AVss: AVss; P6.2/A2: P6.2/A2; P6.1/A1: P6.1/A1; P6.0/A0: P6.0/A0; RST/NMI: RST/NMI; TCK: TCK; TMS: TMS; TDI/TCLK: TDI/TCLK; TDO/TDI: TDO/TDI; XT2IN: XT2IN; XT2OUT: XT2OUT; P5.7/TBoutH/SVSOUT: P5.7/TBoutH/SVSOUT; P5.6/ACLK: P5.6/ACLK; P5.5/SMCLK: P5.5/SMCLK; DVcc: DVcc; P6.3/A3: P6.3/A3; P6.4/A4: P6.4/A4; P6.5/A5: P6.5/A5; P6.6/A6/DAC0: P6.6/A6/DAC0; P6.7/A7/DAC1/SVSIN: P6.7/A7/DAC1/SVSIN; VREF+: VREF+; XIN: XIN; XOUT/TCLK: XOUT/TCLK; VeREF+: VeREF+; VREF-/VeREF-: VREF-/VeREF-; P1.0/TACLK: P1.0/TACLK; P1.1/TA0: P1.1/TA0; P1.2/TA1: P1.2/TA1; P1.3/TA2: P1.3/TA2; P1.4/SMCLK: P1.4/SMCLK; P1.5/TA0: P1.5/TA0; P1.6/TA1: P1.6/TA1; P1.7/TA2: P1.7/TA2; P2.0/ACLK: P2.0/ACLK; P2.1/TAINCLK: P2.1/TAINCLK; P2.2/CAOUT/TA0: P2.2/CAOUT/TA0; P2.3/CA0/TA1: P2.3/CA0/TA1; P2.4/CA1/TA2: P2.4/CA1/TA2; P2.5/Rosc: P2.5/Rosc; P2.6/ADC12CLK/DMAE0: P2.6/ADC12CLK/DMAE0; P2.7/TA0: P2.7/TA0; P3.0/STE0: P3.0/STE0; P3.1/SIMO0/SDA: P3.1/SIMO0/SDA; P3.2/SOMI0: P3.2/SOMI0; P3.3/UCLK0/SCL: P3.3/UCLK0/SCL; P3.4/UTXD0: P3.4/UTXD0; P5.4/MCLK: P5.4/MCLK; P5.3UCLK1: P5.3UCLK1; P5.2/SOMI1: P5.2/SOMI1; P5.1SIMO1: P5.1SIMO1; P5.0/STE1: P5.0/STE1; P4.7/TBCLK: P4.7/TBCLK; P4.6/TB6: P4.6/TB6; P4.5/TB5: P4.5/TB5; P4.4/TB4: P4.4/TB4; P4.3/TB3: P4.3/TB3; P4.2/TB2: P4.2/TB2; P4.1/TB1: P4.1/TB1; P4.0/TB0: P4.0/TB0; P3.7/URXD1: P3.7/URXD1; P3.6/UTXD1: P3.6/UTXD1; P3.5/URXD0: P3.5/URXD0; >VALUE: MSP430F1611
U10 = MAX6369: <B>MAX6369</B> / <ul> / <li>Pin-Selectable Watchdog Timers</li> / <li>Max 6369 is Open-drain output</li> / <li>1 ms to 60 s seletable timeout</li> / </ul>; WDI: WDI; GND: GND; N.C.: N.C.; SET0: SET0; SET1: SET1; SET2: SET2; /WDO: /WDO; VCC: VCC; >VALUE: MAX6369
U11 = TPS3838: <b>TPS3838</b> / <br /> / NanoPower Supervisory IC from texas instruments.<br /> / TPS3838 is open-drain output; >VALUE: TPS3838; CT: CT; /MR: /MR; GND: GND; VDD: VDD; /RST: /RST
U12 = MAX890L: <B>MAX 890L</B> / <BR /> / 1.2A, Current-Limited, High-Side / P-Channel Switch with Thermal Shutdown BY MAXIM; IN: IN; /ON: /ON; GND: GND; SET: SET; OUT: OUT; /FAULT: /FAULT; >VALUE: MAX890L
U13 = MCP1700_SOT23: MCP1700 LDO from Microchips; >VALUE: MCP1700_SOT23; IN: IN; GND: GND; OUT: OUT
X3 = M03PTH: <b>Header 3</b> / Standard 3-pin 0.1" header. Use with straight break away headers (SKU : PRT-00116), right angle break away headers (PRT-00553), swiss pins (PRT-00743), machine pins (PRT-00117), and female headers (PRT-00115). Molex polarized connector foot print use with SKU : PRT-08232 with associated crimp pins and housings.; >VALUE: M03PTH
U$1 = OSSILOGORECT: OSSI: OSSI; LOGO: LOGO
X4 X6 = P-PAD-S: >VALUE: P-PAD-S
X5 = 5268-03: >VALUE: 5268-03
X7 = JTAG10PINMINI-H: >VALUE: JTAG10PINMINI-H

## Nets that join several sheets
3.3VCOMMS: OSSI-1 COMMS_1 (R12.1), OSSI-1 COMMS_3 (20 pins)
GND: OSSI-1 COMMS_0 (5 pins), OSSI-1 COMMS_1 (63 pins), OSSI-1 COMMS_2 (54 pins), OSSI-1 COMMS_3 (30 pins)
VBUS: OSSI-1 COMMS_0 (X1.7 X1.8 X1.9 X1.10), OSSI-1 COMMS_1 (7 pins), OSSI-1 COMMS_3 (U12.1 U12.2)
VCCRF: OSSI-1 COMMS_1 (7 pins), OSSI-1 COMMS_2 (26 pins), OSSI-1 COMMS_3 (C93.1 L16.2)
COMMS_-FAULT: OSSI-1 COMMS_0 (X1.32), OSSI-1 COMMS_3 (U12.8)
COMMS_OFF: OSSI-1 COMMS_0 (X1.25), OSSI-1 COMMS_3 (C87.1 R43.2 U12.3)
COMMS_SCL: OSSI-1 COMMS_0 (X1.41), OSSI-1 COMMS_3 (R30.1 R32.1 X3.2)
COMMS_SDA: OSSI-1 COMMS_0 (X1.43), OSSI-1 COMMS_3 (R27.1 R31.1 X3.1)
COMMSRX_CE: OSSI-1 COMMS_2 (U7.24), OSSI-1 COMMS_3 (U9.21)
COMMSRX_CLK: OSSI-1 COMMS_2 (U7.35), OSSI-1 COMMS_3 (R35.2)
COMMSRX_DATA: OSSI-1 COMMS_2 (U7.34), OSSI-1 COMMS_3 (R34.2)
COMMSRX_MUXOUT: OSSI-1 COMMS_2 (U7.37), OSSI-1 COMMS_3 (U9.13)
COMMSRX_RFIN: OSSI-1 COMMS_1 (C3.1 L1.2), OSSI-1 COMMS_2 (U7.6)
COMMSRX_RFINB: OSSI-1 COMMS_1 (C1.1 L1.1), OSSI-1 COMMS_2 (U7.7)
COMMSRX_SCLK: OSSI-1 COMMS_2 (U7.28), OSSI-1 COMMS_3 (U9.17)
COMMSRX_SDATA: OSSI-1 COMMS_2 (U7.26), OSSI-1 COMMS_3 (U9.19)
COMMSRX_SLE: OSSI-1 COMMS_2 (U7.25), OSSI-1 COMMS_3 (U9.20)
COMMSRX_SREAD: OSSI-1 COMMS_2 (U7.27), OSSI-1 COMMS_3 (U9.18)
COMMSRX_SWD: OSSI-1 COMMS_2 (U7.33), OSSI-1 COMMS_3 (U9.16)
COMMSTX_CE: OSSI-1 COMMS_2 (U8.24), OSSI-1 COMMS_3 (U9.37)
COMMSTX_CLK: OSSI-1 COMMS_2 (U8.35), OSSI-1 COMMS_3 (R28.2)
COMMSTX_DATA: OSSI-1 COMMS_2 (U8.34), OSSI-1 COMMS_3 (R29.2)
COMMSTX_MUXOUT: OSSI-1 COMMS_2 (U8.37), OSSI-1 COMMS_3 (U9.22)
COMMSTX_RFOUT: OSSI-1 COMMS_1 (C24.1 L14.1), OSSI-1 COMMS_2 (U8.4)
COMMSTX_SCLK: OSSI-1 COMMS_2 (U8.28), OSSI-1 COMMS_3 (U9.25)
COMMSTX_SDATA: OSSI-1 COMMS_2 (U8.26), OSSI-1 COMMS_3 (U9.27)
COMMSTX_SLE: OSSI-1 COMMS_2 (U8.25), OSSI-1 COMMS_3 (U9.36)
COMMSTX_SREAD: OSSI-1 COMMS_2 (U8.27), OSSI-1 COMMS_3 (U9.26)
OBC_-FAULT: OSSI-1 COMMS_0 (X1.34), OSSI-1 COMMS_3 (R33.2 R36.1)
OBC_OFF: OSSI-1 COMMS_0 (X1.26), OSSI-1 COMMS_3 (R37.2)
PA_BIAS: OSSI-1 COMMS_1 (R13.1 R14.1 R16.2), OSSI-1 COMMS_3 (U9.5)
PA_ON: OSSI-1 COMMS_1 (R7.1 R10.2), OSSI-1 COMMS_3 (U9.40)
TX_ON: OSSI-1 COMMS_1 (R1.2 R2.1), OSSI-1 COMMS_3 (U9.38)